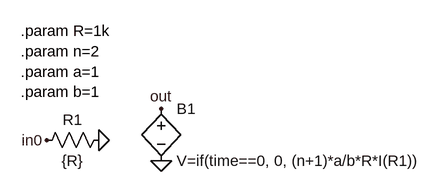
[diagram p0: schematic summer_sj.asc]
summer_sj.asc, the LTspice schematic file:
Version 4
SHEET 1 880 680
FLAG 48 112 in0
FLAG 128 112 0
FLAG 224 144 0
FLAG 224 64 out
SYMBOL res 32 128 R270
WINDOW 0 32 56 VTop 2
WINDOW 3 0 56 VBottom 2
SYMATTR InstName R1
SYMATTR Value {R}
SYMBOL bv 224 48 R0
SYMATTR InstName B1
SYMATTR Value V=if(time==0, 0, (n+1)*a/b*R*I(R1))
TEXT 8 -56 Left 2 !.param R=1k\n.param n=2\n.param a=1\n.param b=1

The netlist it stands for:
* summer_sj.asc
R1 in0 0 {R}
B1 out 0 V=if(time==0, 0, (n+1)*a/b*R*I(R1))
.param R=1k
.param n=2
.param a=1
.param b=1
.backanno
.end